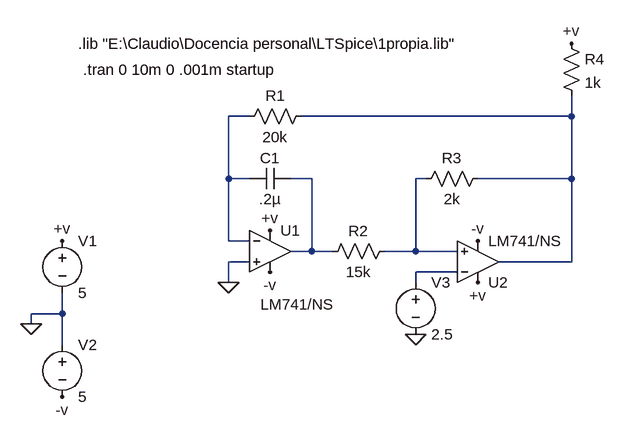
[diagram p0: schematic TriWave.asc]
TriWave.asc, the LTspice schematic file:
Version 4
SHEET 1 880 680
WIRE 96 -48 64 -48
WIRE 592 -48 592 -80
WIRE 592 -48 176 -48
WIRE 64 48 64 -48
WIRE 96 48 64 48
WIRE 192 48 160 48
WIRE 368 48 352 48
WIRE 592 48 592 -48
WIRE 592 48 448 48
WIRE 64 144 64 48
WIRE 96 144 64 144
WIRE 192 160 192 48
WIRE 192 160 160 160
WIRE 224 160 192 160
WIRE 352 160 352 48
WIRE 352 160 304 160
WIRE 416 160 352 160
WIRE 96 176 64 176
WIRE 592 176 592 48
WIRE 592 176 480 176
WIRE 416 192 352 192
WIRE 64 208 64 176
WIRE 352 208 352 192
WIRE -192 256 -192 224
WIRE -192 256 -240 256
WIRE -240 272 -240 256
WIRE -192 304 -192 256
FLAG -240 272 0
FLAG -192 144 +v
FLAG 128 128 +v
FLAG 448 208 +v
FLAG -192 384 -v
FLAG 128 192 -v
FLAG 64 208 0
FLAG 592 -160 +v
FLAG 352 288 0
FLAG 448 144 -v
SYMBOL OpAmps\\opamp2 128 96 R0
WINDOW 3 -15 146 Left 2
SYMATTR Value LM741/NS
SYMATTR InstName U1
SYMBOL OpAmps\\opamp2 448 240 M180
SYMATTR InstName U2
SYMATTR Value LM741/NS
SYMBOL voltage -192 128 R0
WINDOW 123 0 0 Left 0
WINDOW 39 0 0 Left 0
SYMATTR InstName V1
SYMATTR Value 5
SYMBOL voltage -192 288 R0
WINDOW 123 0 0 Left 0
WINDOW 39 0 0 Left 0
SYMATTR InstName V2
SYMATTR Value 5
SYMBOL cap 160 32 R90
WINDOW 0 0 32 VBottom 2
WINDOW 3 32 32 VTop 2
SYMATTR InstName C1
SYMATTR Value .2µ
SYMBOL res 192 -64 R90
WINDOW 0 0 56 VBottom 2
WINDOW 3 32 56 VTop 2
SYMATTR InstName R1
SYMATTR Value 20k
SYMBOL res 320 144 R90
WINDOW 0 0 56 VBottom 2
WINDOW 3 32 56 VTop 2
SYMATTR InstName R2
SYMATTR Value 15k
SYMBOL res 464 32 R90
WINDOW 0 0 56 VBottom 2
WINDOW 3 32 56 VTop 2
SYMATTR InstName R3
SYMATTR Value 2k
SYMBOL res 576 -176 R0
SYMATTR InstName R4
SYMATTR Value 1k
SYMBOL voltage 352 192 R0
WINDOW 123 0 0 Left 0
WINDOW 39 0 0 Left 0
SYMATTR InstName V3
SYMATTR Value 2.5
TEXT -168 -160 Left 2 !.lib "E:\\Claudio\\Docencia personal\\LTSpice\\1propia.lib"
TEXT -160 -120 Left 2 !.tran 0 10m 0 .001m startup

The netlist it stands for:
* TriWave.asc
XU1 0 N001 +v -v N003 LM741/NS  ; pins In+ In- V+ V- OUT
XU2 N004 N005 +v -v N002 LM741/NS  ; pins In+ In- V+ V- OUT
V1 +v 0 5
V2 0 -v 5
C1 N003 N001 .2µ
R1 N002 N001 20k
R2 N004 N003 15k
R3 N002 N004 2k
R4 +v N002 1k
V3 N005 0 2.5
.lib "E:\Claudio\Docencia personal\LTSpice\1propia.lib"
.tran 0 10m 0 .001m startup
.backanno
.end